# Altium project AQCA-Control-Interface.PrjPCB
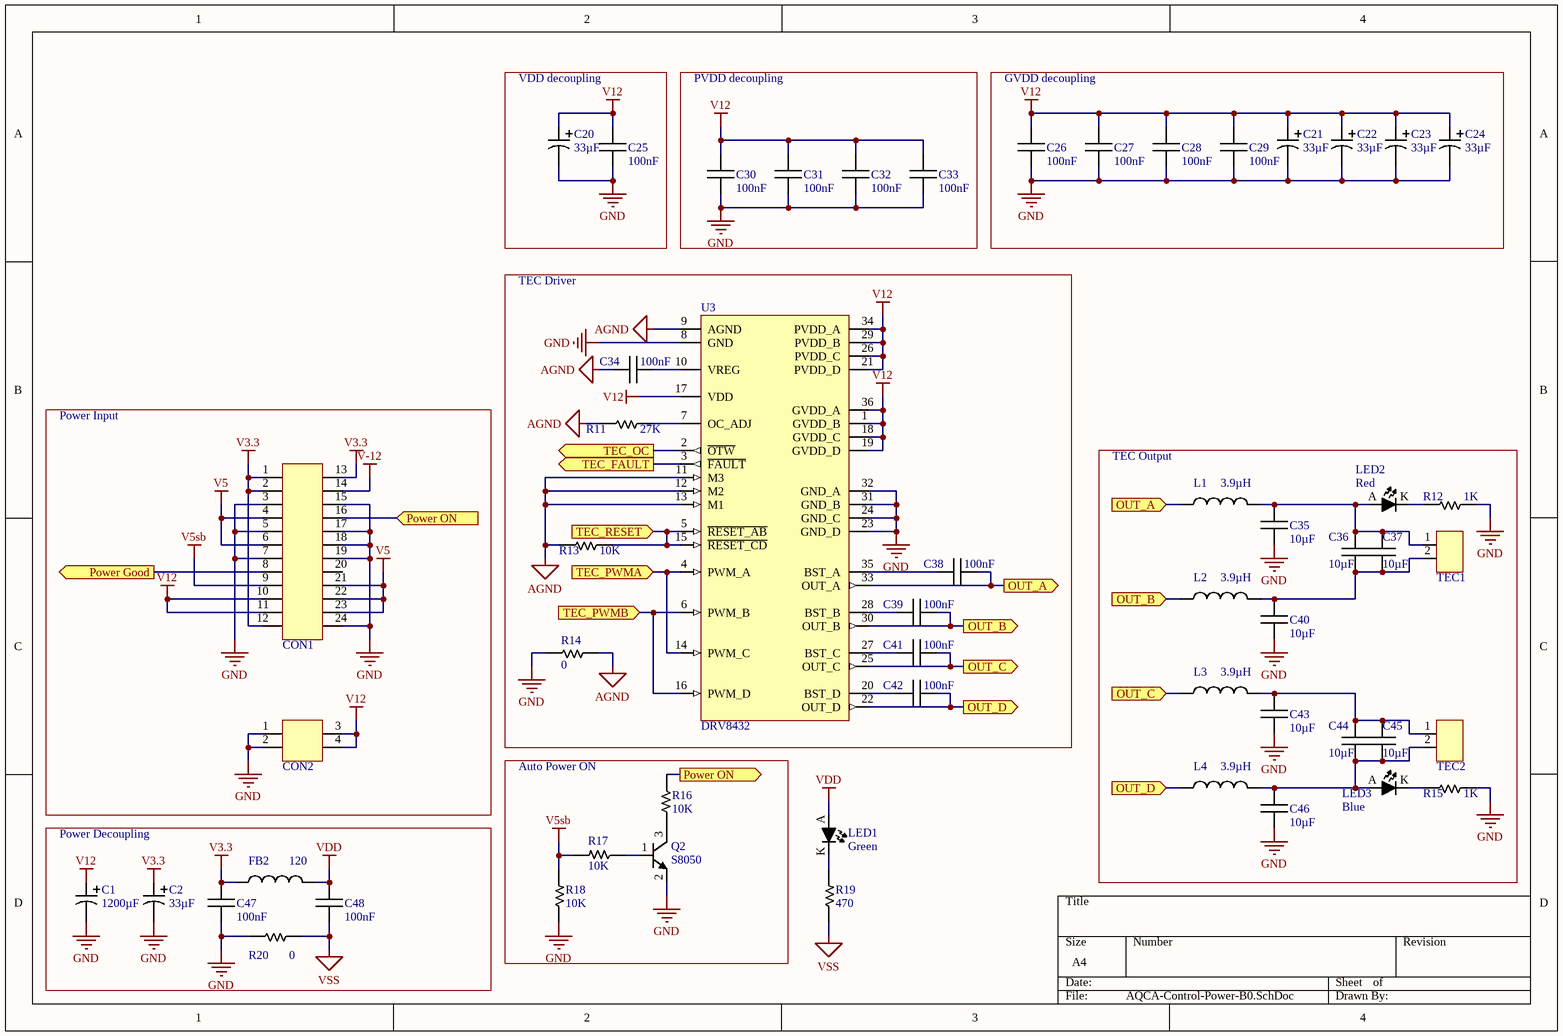
[diagram p0: AQCA-Control-Power-B0.SchDoc]
3 sheets, 136 parts. Net scope: flat (ports and power ports of the same name join across sheets).
Board file: AQCA-Control-Interface.PcbDoc
Sheets:
  AQCA-Control-Power-B0.SchDoc
  AQCA-Control-uC-B0.SchDoc
  AQCA-Control-IO-B0.SchDoc

## Sheet AQCA-Control-Power-B0.SchDoc
size A4

### Parts
(Parts that share a designator on the sheet are numbered #1, #2 ... from top to bottom, then left to right.)
C1  1200µF  [CAPPR7.5-18x35.5]
C2#1  33µF  [CAPPR2-5x11]
C20  33µF  [CAPPR2-5x11]
C21  33µF  [CAPPR2-5x11]
C22  33µF  [CAPPR2-5x11]
C23  33µF  [CAPPR2-5x11]
C24  33µF  [CAPPR2-5x11]
C25  100nF  [CAPC1608N]
C26  100nF  [CAPC1608N]
C27  100nF  [CAPC1608N]
C28  100nF  [CAPC1608N]
C29  100nF  [CAPC1608N]
C30  100nF  [CAPC1608N]
C31  100nF  [CAPC1608N]
C32  100nF  [CAPC1608N]
C33  100nF  [CAPC1608N]
C34  100nF  [CAPC1608N]
C35  10µF  [CAPC3225N]
C36  10µF  [CAPC3225N]
C37  10µF  [CAPC3225N]
C38  100nF  [CAPC1608N]
C39  100nF  [CAPC1608N]
C40  10µF  [CAPC3225N]
C41  100nF  [CAPC1608N]
C42  100nF  [CAPC1608N]
C43  10µF  [CAPC3225N]
C44  10µF  [CAPC3225N]
C45  10µF  [CAPC3225N]
C46  10µF  [CAPC3225N]
C47  100nF  [CAPC1608N]
C48  100nF  [CAPC1608N]
CON1  Molex Mini-Fit 24pin  [Molex Mini-Fit 24pin 90deg]  (value not drawn)
CON2  Molex Mini-Fit 4pin  [Molex Mini-Fit 4pin 90deg]  (value not drawn)
FB2  120  [INDC1608N]
L1  3.9µH  [Inductor AIUR5-6]
L2  3.9µH  [Inductor AIUR5-6]
L3  3.9µH  [Inductor AIUR5-6]
L4  3.9µH  [Inductor AIUR5-6]
LED1  Green  [LED 3216m]
LED2  Red  [LED 3216m]
LED3  Blue  [LED 3216m]
Q2  S8050  [SOT23_N]
R11  27K  [RESC1608N]
R12  1K  [RESC1608N]
R13  10K  [RESC1608N]
R14  0  [RESC1608N]
R15  1K  [RESC1608N]
R16  10K  [RESC1608N]
R17  10K  [RESC1608N]
R18  10K  [RESC1608N]
R19  470  [RESC1608N]
R20  0  [RESC1608N]
TEC1  High-Power Connector 2p  [High-Power Connector 2]  (value not drawn)
TEC2  High-Power Connector 2p  [High-Power Connector 2]  (value not drawn)
U3  DRV8432  [PSOP3-36]

### Blocks framed on the sheet
VDD decoupling: C20 C25
PVDD decoupling: C30-C33
GVDD decoupling: C21-C24 C26-C29
TEC Driver: C34 C38 C39 C41 C42 R11 R13 R14 U3
Power Input: CON1 CON2
TEC Output: C35-C37 C40 C43-C46 L1-L4 LED2 LED3 R12 R15 TEC1 TEC2
Auto Power ON: Q2 R16-R18
Power Decoupling: C1 C2#1 C47 C48 FB2 R20

### Ports
OUT_A (in), OUT_A (out), OUT_B (in), OUT_B (out), OUT_C (in), OUT_C (out), OUT_D (in), OUT_D (out), Power Good (out), Power ON (in), Power ON (out), TEC_FAULT (out), TEC_OC (out), TEC_PWMA (in), TEC_PWMB (in), TEC_RESET (in)

### Nets
AGND: C34.2 R11.1 R13.1 R14.2 U3.9(AGND) U3.11(M3) U3.12(M2) U3.13(M1)
GND: C1.2 C2#1.2 C20.2 C21.2 C22.2 C23.2 C24.2 C25.1 C26.1 C27.1 C28.1 C29.1 C30.1 C31.1 C32.1 C33.1 C35.1 C40.1 C43.1 C46.1 C47.2 CON1.3 CON1.5 CON1.7 CON1.15 CON1.17 CON1.18 CON1.19 CON1.24 CON2.1 CON2.2 Q2.2(E) R12.2 R14.1 R15.2 R18.1 R20.1 U3.8(GND) U3.23(GND_D) U3.24(GND_C) U3.31(GND_B) U3.32(GND_A)
V3.3: C2#1.1 C47.1 CON1.1 CON1.2 CON1.12 CON1.13 FB2.1
V5: CON1.4 CON1.6 CON1.21 CON1.22 CON1.23
V5sb: CON1.9 R17.2 R18.2
V12: C1.1 C20.1 C21.1 C22.1 C23.1 C24.1 C25.2 C26.2 C27.2 C28.2 C29.2 C30.2 C31.2 C32.2 C33.2 CON1.10 CON1.11 CON2.3 CON2.4 U3.1(GVDD_B) U3.17(VDD) U3.18(GVDD_C) U3.19(GVDD_D) U3.21(PVDD_D) U3.26(PVDD_C) U3.29(PVDD_B) U3.34(PVDD_A) U3.36(GVDD_A)
V-12: CON1.14
VDD: C48.1 FB2.2 LED1.A
VSS: C48.2 R19.1 R20.2
NetC34_1: C34.1 U3.10(VREG)
NetC35_2: C35.2 C36.2 C37.2 L1.2 LED2.A TEC1.1
NetC36_1: C36.1 C37.1 C40.2 L2.2 TEC1.2
NetC38_1: C38.1 U3.35(BST_A)
NetC38_2: C38.2 L1.1 U3.33(OUT_A) ; port OUT_A
NetC39_1: C39.1 U3.28(BST_B)
NetC39_2: C39.2 L2.1 U3.30(OUT_B) ; port OUT_B
NetC41_1: C41.1 U3.27(BST_C)
NetC41_2: C41.2 L3.1 U3.25(OUT_C) ; port OUT_C
NetC42_1: C42.1 U3.20(BST_D)
NetC42_2: C42.2 L4.1 U3.22(OUT_D) ; port OUT_D
NetC43_2: C43.2 C44.2 C45.2 L3.2 TEC2.1
NetC44_1: C44.1 C45.1 C46.2 L4.2 LED3.A TEC2.2
NetCON1_8: CON1.8 ; port Power Good
NetCON1_16: CON1.16 R16.1 ; port Power ON
NetLED1_K: LED1.K R19.2
NetLED2_K: LED2.K R12.1
NetLED3_K: LED3.K R15.1
NetQ2_1: Q2.1(B) R17.1
NetQ2_3: Q2.3(C) R16.2
NetR11_2: R11.2 U3.7(OC_ADJ)
NetR13_2: R13.2 U3.5(~{RESET_AB}) U3.15(~{RESET_CD}) ; port TEC_RESET
NetU2_32: U3.2(~{OTW}) ; port TEC_OC
NetU2_33: U3.4(PWM_A) U3.14(PWM_C) ; port TEC_PWMA
NetU2_34: U3.3(~{FAULT}) ; port TEC_FAULT
NetU2_35: U3.6(PWM_B) U3.16(PWM_D) ; port TEC_PWMB

Not connected (* = marked no-connect by the designer): CON1 20

### Library data of the parts
C1 = Capacitor Polarised: Voltage Rating: 25V; Value: 1200µF
C2#1 C20-C24 = Capacitor Polarised: Voltage Rating: 50V; Value: 33µF
C25-C34 C38 C39 C41 C42 C47 C48 = Capacitor: Voltage: 25V; Value: 100nF
C35-C37 C40 C43-C46 = Capacitor: Value: 10µF
FB2 = Inductor: DC Current: 700mA; Value: 120
L1-L4 = Inductor: Value: 3.9µH
LED1 = LED: Vf: 3.2V; If: 20mA; Color: Green
LED2 LED3 = LED
  LED2: Color: Red
  LED3: Color: Blue
Q2 = NPN: pin to pad: 1>3 3>1; Model: S8050
R11-R20 = Resistor
  R11: Value: 27K
  R12 R15: Value: 1K
  R13 R16-R18: Value: 10K
  R14 R20: Value: 0
  R19: Value: 470

## Sheet AQCA-Control-uC-B0.SchDoc
size A4
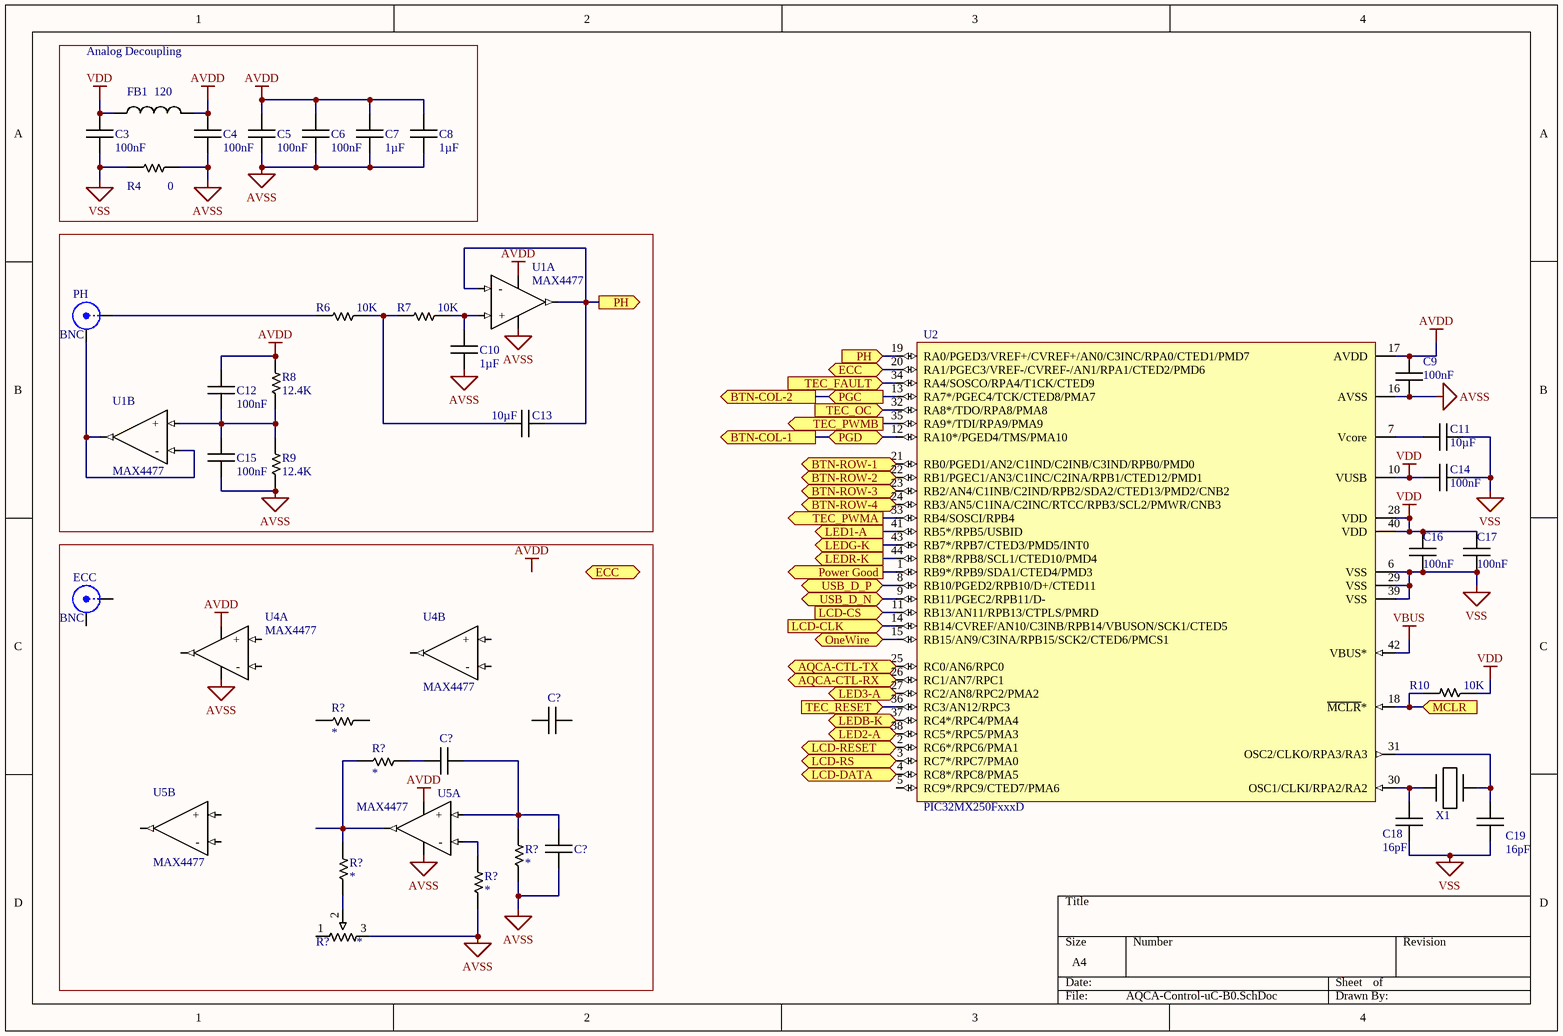
[diagram p1: AQCA-Control-uC-B0.SchDoc]

### Parts
(Parts that share a designator on the sheet are numbered #1, #2 ... from top to bottom, then left to right.)
C3  100nF  [CAPC1608N]
C4  100nF  [CAPC1608N]
C5  100nF  [CAPC1608N]
C6  100nF  [CAPC1608N]
C7  1µF  [CAPC1608N]
C8  1µF  [CAPC1608N]
C9  100nF  [CAPC1608N]
C10  1µF  [CAPC1608N]
C11  10µF  [CAPC2012N]
C12  100nF  [CAPC1608N]
C13  10µF  [CAPC3225N]
C14  100nF  [CAPC1608N]
C15  100nF  [CAPC1608N]
C16  100nF  [CAPC1608N]
C17  100nF  [CAPC1608N]
C18  16pF  [CAPC1608N]
C19  16pF  [CAPC1608N]
C?#1  (no value)  [CAPC1608N]
C?#2  (no value)  [CAPC1608N]
C?#3  (no value)  [CAPC1608N]
ECC  BNC  [BNC_RA CON]
FB1  120  [INDC1608N]
PH  BNC  [BNC_RA CON]
R4  0  [RESC1608N]
R6  10K  [RESC1608N]
R7  10K  [RESC1608N]
R8  12.4K  [RESC1608N]
R9  12.4K  [RESC1608N]
R10  10K  [RESC1608N]
R?#1  *  [RESC1608N]
R?#2  *  [RESC1608N]
R?#3  *  [RESC1608N]
R?#4  *  [RESC1608N]
R?#5  *  [RESC1608N]
R?#6  *  [Trim-Pot 2mm SMD]
U1  MAX4477  [UMAX8_N]  (parts A,B of 2)
U2  PIC32MX250FxxxD  [TQFP44_N]
U4  MAX4477  [UMAX8_N]  (parts A,B of 2)
U5  MAX4477  [UMAX8_N]  (parts A,B of 2)
X1  Crystal  [Quartz Can 2.1mm Hor]  (value not drawn)

### Blocks framed on the sheet
Analog Decoupling: C3-C8 FB1 R4

### Ports
AQCA-CTL-RX (in), AQCA-CTL-TX (out), BTN-COL-1 (out), BTN-COL-2 (out), BTN-ROW-1 (in), BTN-ROW-2 (in), BTN-ROW-3 (in), BTN-ROW-4 (in), ECC, LCD-CLK (in), LCD-CS (in), LCD-DATA (in), LCD-RESET (in), LCD-RS (in), LED1-A (out), LED2-A (out), LED3-A (out), LEDB-K (out), LEDG-K (out), LEDR-K (out), MCLR (in), OneWire (bidir), PGC (in), PGD (bidir), PH (in), PH (out), Power Good (out), TEC_FAULT (in), TEC_OC (in), TEC_PWMA (out), TEC_PWMB (out), TEC_RESET (in), USB_D_N (bidir), USB_D_P (bidir)

### Nets
AVDD: C4.2 C5.2 C6.2 C7.2 C8.2 C9.2 C12.2 FB1.2 R8.2 U1.8(V+) U2.17(AVDD) U4.4(V-) U5.4(V-)
AVSS: C4.1 C5.1 C6.1 C7.1 C8.1 C9.1 C10.1 C15.1 C?#3.1 R4.2 R9.1 R?#3.1 R?#5.1 R?#6.3 U1.4(V-) U2.16(AVSS) U4.8(V+) U5.8(V+)
VBUS: U2.42(VBUS*)
VDD: C3.2 C14.2 C16.2 C17.2 FB1.1 R10.1 U2.10(VUSB) U2.28(VDD) U2.40(VDD)
VSS: C3.1 C11.2 C14.1 C16.1 C17.1 C18.1 C19.1 R4.1 U2.6(VSS) U2.29(VSS) U2.39(VSS)
USB_D_N: U2.9(RB11/PGEC2/RPB11/D-) ; port USB_D_N
USB_D_P: U2.8(RB10/PGED2/RPB10/D+/CTED11) ; port USB_D_P
NetA_1: U2.21(RB0/PGED1/AN2/C1IND/C2INB/C3IND/RPB0/PMD0) ; port BTN-ROW-1
NetA_2: U2.13(RA7*/PGEC4/TCK/CTED8/PMA7) ; port PGC, port BTN-COL-2
NetB_1: U2.22(RB1/PGEC1/AN3/C1INC/C2INA/RPB1/CTED12/PMD1) ; port BTN-ROW-2
NetC10_2: C10.2 R7.2 U1.3(+)
NetC11_1: C11.1 U2.7(Vcore)
NetC12_1: C12.1 C15.2 R8.1 R9.2 U1.5(+)
NetC13_1: C13.1 U1.1(O) U1.2(-) U2.19(RA0/PGED3/VREF+/CVREF+/AN0/C3INC/RPA0/CTED1/PMD7) ; port PH
NetC13_2: C13.2 R6.2 R7.1
NetC18_2: C18.2 U2.30(OSC1/CLKI/RPA2/RA2) X1.1
NetC19_2: C19.2 U2.31(OSC2/CLKO/RPA3/RA3) X1.2
NetC?#2_1: C?#2.1 R?#2.2
NetC?#2_2: C?#2.2 C?#3.2 R?#3.2 U5.3(+)
NetC_1: U2.23(RB2/AN4/C1INB/C2IND/RPB2/SDA2/CTED13/PMD2/CNB2) ; port BTN-ROW-3
NetCON1_8: U2.1(RB9*/RPB9/SDA1/CTED4/PMD3) ; port Power Good
NetCON3_3: U2.26(RC1/AN7/RPC1) ; port AQCA-CTL-RX
NetDOWN_1: U2.24(RB3/AN5/C1INA/C2INC/RTCC/RPB3/SCL2/PMWR/CNB3) ; port BTN-ROW-4
NetDOWN_2: U2.12(RA10*/PGED4/TMS/PMA10) ; port PGD, port BTN-COL-1
NetICSP_1: R10.2 U2.18(~{MCLR}*) ; port MCLR
NetLCD1_6: U2.2(RC6*/RPC6/PMA1) ; port LCD-RESET
NetLCD1_7: U2.3(RC7*/RPC7/PMA0) ; port LCD-RS
NetLCD1_8: U2.4(RC8*/RPC8/PMA5) ; port LCD-DATA
NetLCD1_9: U2.14(RB14/CVREF/AN10/C3INB/RPB14/VBUSON/SCK1/CTED5) ; port LCD-CLK
NetLCD1_12: U2.11(RB13/AN11/RPB13/CTPLS/PMRD) ; port LCD-CS
NetPH_1: PH.1(X) R6.1
NetPH_2: PH.2(Y) U1.6(-) U1.7(O)
NetR3_1: U2.25(RC0/AN6/RPC0) ; port AQCA-CTL-TX
NetR13_2: U2.36(RC3/AN12/RPC3) ; port TEC_RESET
NetR21_1: U2.44(RB8*/RPB8/SCL1/CTED10/PMD4) ; port LEDR-K
NetR22_1: U2.43(RB7*/RPB7/CTED3/PMD5/INT0) ; port LEDG-K
NetR24_1: U2.37(RC4*/RPC4/PMA4) ; port LEDB-K
NetR25_2: U2.41(RB5*/RPB5/USBID) ; port LED1-A
NetR26_2: U2.38(RC5*/RPC5/PMA3) ; port LED2-A
NetR27_1: U2.27(RC2/AN8/RPC2/PMA2) ; port LED3-A
NetR?#2_1: R?#2.1 R?#4.2 U5.1(O)
NetR?#4_1: R?#4.1 R?#6.2
NetR?#5_2: R?#5.2 U5.2(-)
NetU2_15: U2.15(RB15/AN9/C3INA/RPB15/SCK2/CTED6/PMCS1) ; port OneWire
NetU2_20: U2.20(RA1/PGEC3/VREF-/CVREF-/AN1/RPA1/CTED2/PMD6) ; port ECC
NetU2_32: U2.32(RA8*/TDO/RPA8/PMA8) ; port TEC_OC
NetU2_33: U2.33(RB4/SOSCI/RPB4) ; port TEC_PWMA
NetU2_34: U2.34(RA4/SOSCO/RPA4/T1CK/CTED9) ; port TEC_FAULT
NetU2_35: U2.35(RA9*/TDI/RPA9/PMA9) ; port TEC_PWMB

Not connected (* = marked no-connect by the designer): C?#1 1 2; ECC 1(X) 2(Y); R?#1 1 2; R?#6 1; U2 5(RC9*/RPC9/CTED7/PMA6); U4 1(O) 2(-) 3(+) 5(+) 6(-) 7(O); U5 5(+) 6(-) 7(O)

### Notes on the sheet
- Labels drawn without touching a wire or pin: AVDD

### Library data of the parts
C3-C6 C9 C10 C12-C17 = Capacitor: Voltage: 16V
  C3-C6 C9 C12 C14-C17: Value: 100nF
  C10: Value: 1µF
  C13: Value: 10µF
C7 C8 = Capacitor: Voltage: 25V; Value: 1µF
C11 = Capacitor: Voltage: 10V; Value: 10µF
C18 C19 = Capacitor: Voltage: 50V; Value: 16pF
C?#1-C?#3 = Capacitor
ECC PH = BNC: BNC Elbow Connector; LatestRevisionDate: 17-Jul-2002; LatestRevisionNote: Re-released for DXP Platform.; Publisher: Altium Limited
FB1 = Inductor: DC Current: 700mA; Value: 120
R4 R6-R10 R?#1-R?#5 = Resistor
  R4: Value: 0
  R6 R7 R10: Value: 10K
  R8 R9: Value: 12.4K
  R?#1-R?#5: Value: *
R?#6 = Potentiometer: Value: *
U1 U4 U5 = Opamp dual: Model: MAX4477
U2 = PIC32MX250FxxxD: Model: PIC32MX250F128D
X1 = Crystal: Frequency: 116MHz; Precision: 100ppm; Stability: 100ppm

## Sheet AQCA-Control-IO-B0.SchDoc
size A4
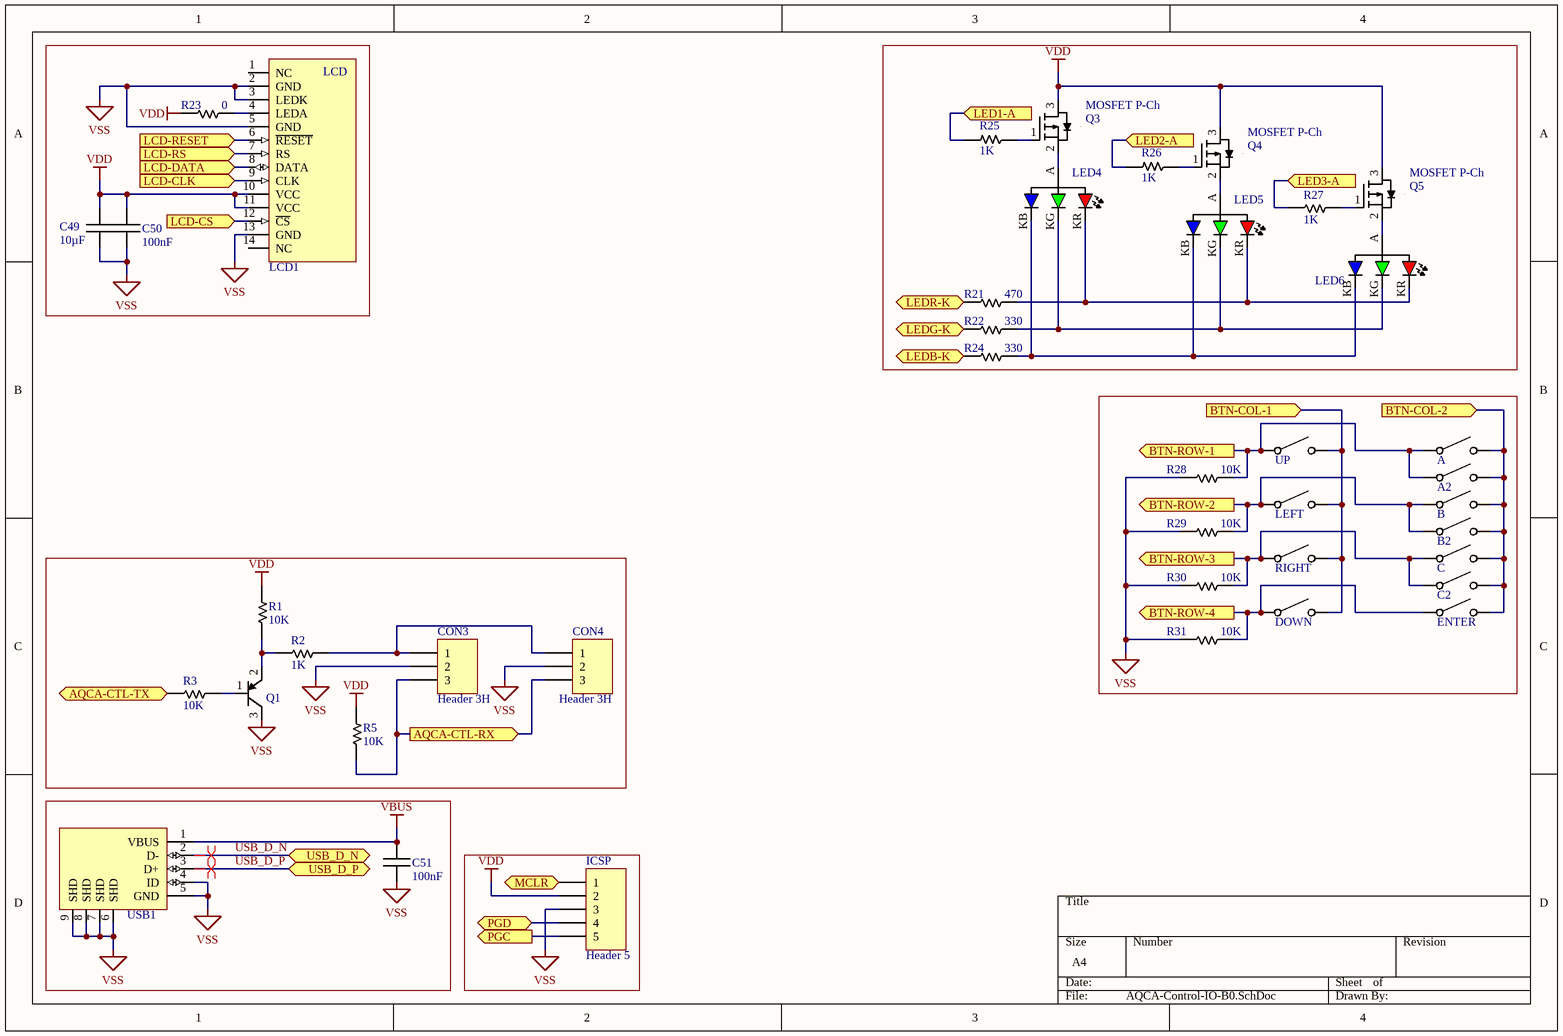
[diagram p2: AQCA-Control-IO-B0.SchDoc]

### Parts
(Parts that share a designator on the sheet are numbered #1, #2 ... from top to bottom, then left to right.)
A  Tact Button NO  [TACT SMD 4.5×4.5mm]  (value not drawn)
A2  Tact Button NO  [TACT SMD 4.5×4.5mm]  (value not drawn)
B  Tact Button NO  [TACT SMD 4.5×4.5mm]  (value not drawn)
B2  Tact Button NO  [TACT SMD 4.5×4.5mm]  (value not drawn)
C  Tact Button NO  [TACT SMD 4.5×4.5mm]  (value not drawn)
C2#2  Tact Button NO  [TACT SMD 4.5×4.5mm]  (value not drawn)
C49  10µF  [CAPC3225N]
C50  100nF  [CAPC1608N]
C51  100nF  [CAPC1608N]
CON3  Header 3H  [HDR1X3H]
CON4  Header 3H  [HDR1X3H]
DOWN  Tact Button NO  [TACT SMD 4.5×4.5mm]  (value not drawn)
ENTER  Tact Button NO  [TACT SMD 4.5×4.5mm]  (value not drawn)
ICSP  Header 5  [HDR1X5]
LCD1  LCD JD-T1800  [LCD JD-T1800]  (value not drawn)
LED4  LED RGB common A  [LED 3528m]  (value not drawn)
LED5  LED RGB common A  [LED 3528m]  (value not drawn)
LED6  LED RGB common A  [LED 3528m]  (value not drawn)
LEFT  Tact Button NO  [TACT SMD 4.5×4.5mm]  (value not drawn)
Q1  *  [SOT23_N]  (value not drawn)
Q3  MOSFET P-Ch  [SOT23-3N]
Q4  MOSFET P-Ch  [SOT23-3N]
Q5  MOSFET P-Ch  [SOT23-3N]
R1  10K  [RESC1608N]
R2  1K  [RESC1608N]
R3  10K  [RESC1608N]
R5  10K  [RESC1608N]
R21  470  [RESC1608N]
R22  330  [RESC1608N]
R23  0  [RESC1608N]
R24  330  [RESC1608N]
R25  1K  [RESC1608N]
R26  1K  [RESC1608N]
R27  1K  [RESC1608N]
R28  10K  [RESC1608N]
R29  10K  [RESC1608N]
R30  10K  [RESC1608N]
R31  10K  [RESC1608N]
RIGHT  Tact Button NO  [TACT SMD 4.5×4.5mm]  (value not drawn)
UP  Tact Button NO  [TACT SMD 4.5×4.5mm]  (value not drawn)
USB1  USB-Conn Mini-B SMD  [440478]  (value not drawn)

### Ports
AQCA-CTL-RX (out), AQCA-CTL-TX (in), BTN-COL-1 (in), BTN-COL-2 (in), BTN-ROW-1 (out), BTN-ROW-2 (out), BTN-ROW-3 (out), BTN-ROW-4 (out), LCD-CLK (in), LCD-CS (in), LCD-DATA (in), LCD-RESET (in), LCD-RS (in), LED1-A (in), LED2-A (in), LED3-A (in), LEDB-K (in), LEDG-K (in), LEDR-K (in), MCLR (out), PGC (out), PGD (bidir), USB_D_N (bidir), USB_D_P (bidir)

### Nets
VBUS: C51.2 USB1.1(VBUS)
VDD: C49.2 C50.2 ICSP.2 LCD1.10(VCC) LCD1.11(VCC) Q3.3(D) Q4.3(D) Q5.3(D) R1.2 R5.2 R23.1
VSS: C49.1 C50.1 C51.1 CON3.2 CON4.2 ICSP.3 LCD1.2(GND) LCD1.3(LEDK) LCD1.5(GND) LCD1.13(GND) Q1.3(C) R28.1 R29.1 R30.1 R31.1 USB1.4(ID) USB1.5(GND) USB1.6(SHD) USB1.7(SHD) USB1.8(SHD) USB1.9(SHD)
USB_D_N: USB1.2(D-) ; port USB_D_N
USB_D_P: USB1.3(D+) ; port USB_D_P
NetA_1: A.1 A2.1 R28.2 UP.1 ; port BTN-ROW-1
NetA_2: A.2 A2.2 B.2 B2.2 C.2 C2#2.2 ENTER.2 ICSP.5 ; port BTN-COL-2, port PGC
NetB_1: B.1 B2.1 LEFT.1 R29.2 ; port BTN-ROW-2
NetC_1: C.1 C2#2.1 R30.2 RIGHT.1 ; port BTN-ROW-3
NetCON3_1: CON3.1 CON4.1 R2.2
NetCON3_3: CON3.3 CON4.3 R5.1 ; port AQCA-CTL-RX
NetDOWN_1: DOWN.1 ENTER.1 R31.2 ; port BTN-ROW-4
NetDOWN_2: DOWN.2 ICSP.4 LEFT.2 RIGHT.2 UP.2 ; port BTN-COL-1, port PGD
NetICSP_1: ICSP.1 ; port MCLR
NetLCD1_4: LCD1.4(LEDA) R23.2
NetLCD1_6: LCD1.6(~{RESET}) ; port LCD-RESET
NetLCD1_7: LCD1.7(RS) ; port LCD-RS
NetLCD1_8: LCD1.8(DATA) ; port LCD-DATA
NetLCD1_9: LCD1.9(CLK) ; port LCD-CLK
NetLCD1_12: LCD1.12(~{CS}) ; port LCD-CS
NetLED4_A: LED4.A Q3.2(S)
NetLED4_KB: LED4.KB LED5.KB LED6.KB R24.2
NetLED4_KG: LED4.KG LED5.KG LED6.KG R22.2
NetLED4_KR: LED4.KR LED5.KR LED6.KR R21.2
NetLED5_A: LED5.A Q4.2(S)
NetLED6_A: LED6.A Q5.2(S)
NetQ1_1: Q1.1(B) R3.2
NetQ1_2: Q1.2(E) R1.1 R2.1
NetQ3_1: Q3.1(G) R25.1
NetQ4_1: Q4.1(G) R26.1
NetQ5_1: Q5.1(G) R27.2
NetR3_1: R3.1 ; port AQCA-CTL-TX
NetR21_1: R21.1 ; port LEDR-K
NetR22_1: R22.1 ; port LEDG-K
NetR24_1: R24.1 ; port LEDB-K
NetR25_2: R25.2 ; port LED1-A
NetR26_2: R26.2 ; port LED2-A
NetR27_1: R27.1 ; port LED3-A

Not connected (* = marked no-connect by the designer): LCD1 1(NC) 14(NC)

### Layout directives
differential pair: USB_D_N, USB_D_P

### Notes on the sheet
- (in symbol LCD JD-T1800) LCD

### Library data of the parts
A A2 B B2 C C2#2 DOWN ENTER LEFT RIGHT UP = Tact Button NO: pin to pad: 2>4
C49 = Capacitor: Voltage: 25V; Value: 10µF
C50 C51 = Capacitor: Voltage: 16V; Value: 100nF
CON3 CON4 = Header 3H: Header, 3-Pin, Right Angle; LatestRevisionDate: 17-Jul-2002; LatestRevisionNote: Re-released for DXP Platform.; Publisher: Altium Limited
ICSP = Header 5: Header, 5-Pin; LatestRevisionDate: 17-Jul-2002; LatestRevisionNote: Re-released for DXP Platform.; Publisher: Altium Limited
LCD1 = LCD JD-T1800: Resolution: 128*160; Screen Size: 1.8"
LED4-LED6 = LED RGB common A: pin to pad: A>2 KB>3 KG>4 KR>1
Q1 = PNP: pin to pad: 1>3 3>1; Model: *
R1-R3 R5 R21-R31 = Resistor
  R1 R3 R5 R28-R31: Value: 10K
  R2 R25-R27: Value: 1K
  R21: Value: 470
  R22 R24: Value: 330
  R23: Value: 0
Q3-Q5 = MOSFET P-Ch: Model: *

## Nets that join several sheets
VBUS: AQCA-Control-uC-B0 (U2.42), AQCA-Control-IO-B0 (C51.2 USB1.1)
VDD: AQCA-Control-Power-B0 (C48.1 FB2.2 LED1.A), AQCA-Control-uC-B0 (9 pins), AQCA-Control-IO-B0 (11 pins)
VSS: AQCA-Control-Power-B0 (C48.2 R19.1 R20.2), AQCA-Control-uC-B0 (11 pins), AQCA-Control-IO-B0 (21 pins)
NetA_1: AQCA-Control-uC-B0 (U2.21), AQCA-Control-IO-B0 (A.1 A2.1 R28.2 UP.1)
NetA_2: AQCA-Control-uC-B0 (U2.13), AQCA-Control-IO-B0 (8 pins)
NetB_1: AQCA-Control-uC-B0 (U2.22), AQCA-Control-IO-B0 (B.1 B2.1 LEFT.1 R29.2)
NetC_1: AQCA-Control-uC-B0 (U2.23), AQCA-Control-IO-B0 (C.1 C2#2.1 R30.2 RIGHT.1)
NetCON1_8: AQCA-Control-Power-B0 (CON1.8), AQCA-Control-uC-B0 (U2.1)
NetCON3_3: AQCA-Control-uC-B0 (U2.26), AQCA-Control-IO-B0 (CON3.3 CON4.3 R5.1)
NetDOWN_1: AQCA-Control-uC-B0 (U2.24), AQCA-Control-IO-B0 (DOWN.1 ENTER.1 R31.2)
NetDOWN_2: AQCA-Control-uC-B0 (U2.12), AQCA-Control-IO-B0 (5 pins)
NetICSP_1: AQCA-Control-uC-B0 (R10.2 U2.18), AQCA-Control-IO-B0 (ICSP.1)
NetLCD1_6: AQCA-Control-uC-B0 (U2.2), AQCA-Control-IO-B0 (LCD1.6)
NetLCD1_7: AQCA-Control-uC-B0 (U2.3), AQCA-Control-IO-B0 (LCD1.7)
NetLCD1_8: AQCA-Control-uC-B0 (U2.4), AQCA-Control-IO-B0 (LCD1.8)
NetLCD1_9: AQCA-Control-uC-B0 (U2.14), AQCA-Control-IO-B0 (LCD1.9)
NetLCD1_12: AQCA-Control-uC-B0 (U2.11), AQCA-Control-IO-B0 (LCD1.12)
NetR3_1: AQCA-Control-uC-B0 (U2.25), AQCA-Control-IO-B0 (R3.1)
NetR13_2: AQCA-Control-Power-B0 (R13.2 U3.5 U3.15), AQCA-Control-uC-B0 (U2.36)
NetR21_1: AQCA-Control-uC-B0 (U2.44), AQCA-Control-IO-B0 (R21.1)
NetR22_1: AQCA-Control-uC-B0 (U2.43), AQCA-Control-IO-B0 (R22.1)
NetR24_1: AQCA-Control-uC-B0 (U2.37), AQCA-Control-IO-B0 (R24.1)
NetR25_2: AQCA-Control-uC-B0 (U2.41), AQCA-Control-IO-B0 (R25.2)
NetR26_2: AQCA-Control-uC-B0 (U2.38), AQCA-Control-IO-B0 (R26.2)
NetR27_1: AQCA-Control-uC-B0 (U2.27), AQCA-Control-IO-B0 (R27.1)
NetU2_32: AQCA-Control-Power-B0 (U3.2), AQCA-Control-uC-B0 (U2.32)
NetU2_33: AQCA-Control-Power-B0 (U3.4 U3.14), AQCA-Control-uC-B0 (U2.33)
NetU2_34: AQCA-Control-Power-B0 (U3.3), AQCA-Control-uC-B0 (U2.34)
NetU2_35: AQCA-Control-Power-B0 (U3.6 U3.16), AQCA-Control-uC-B0 (U2.35)
USB_D_N: AQCA-Control-uC-B0 (U2.9), AQCA-Control-IO-B0 (USB1.2)
USB_D_P: AQCA-Control-uC-B0 (U2.8), AQCA-Control-IO-B0 (USB1.3)